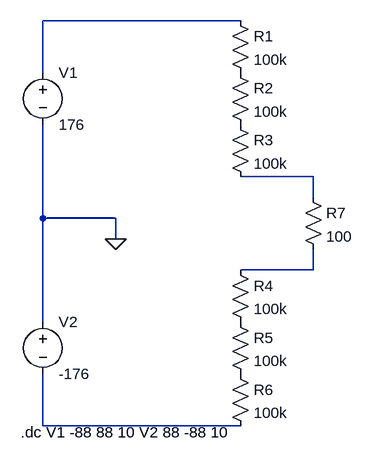
[diagram p0: schematic Voltage2.asc]
Voltage2.asc, the LTspice schematic file:
Version 4
SHEET 1 880 700
WIRE 144 48 -160 48
WIRE -160 128 -160 48
WIRE 256 288 144 288
WIRE 256 320 256 288
WIRE -160 352 -160 208
WIRE -48 352 -160 352
WIRE -48 384 -48 352
WIRE 256 432 256 400
WIRE 256 432 144 432
WIRE -160 512 -160 352
WIRE -160 672 -160 592
WIRE 144 672 -160 672
FLAG -48 384 0
SYMBOL res 128 32 R0
SYMATTR InstName R1
SYMATTR Value 100k
SYMBOL res 128 112 R0
SYMATTR InstName R2
SYMATTR Value 100k
SYMBOL res 128 192 R0
SYMATTR InstName R3
SYMATTR Value 100k
SYMBOL res 128 416 R0
SYMATTR InstName R4
SYMATTR Value 100k
SYMBOL res 128 496 R0
SYMATTR InstName R5
SYMATTR Value 100k
SYMBOL res 128 576 R0
SYMATTR InstName R6
SYMATTR Value 100k
SYMBOL res 240 304 R0
SYMATTR InstName R7
SYMATTR Value 100
SYMBOL voltage -160 112 R0
WINDOW 123 24 124 Left 2
WINDOW 39 0 0 Left 0
SYMATTR InstName V1
SYMATTR Value 176
SYMBOL voltage -160 496 R0
WINDOW 123 24 124 Left 2
WINDOW 39 0 0 Left 0
SYMATTR InstName V2
SYMATTR Value -176
TEXT -194 682 Left 2 !.dc V1 -88 88 10 V2 88 -88 10

The netlist it stands for:
* Voltage2.asc
R1 N001 P001 100k
R2 P001 P002 100k
R3 P002 N002 100k
R4 N003 P003 100k
R5 P003 P004 100k
R6 P004 N004 100k
R7 N002 N003 100
V1 N001 0 176
V2 0 N004 -176
.dc V1 -88 88 10 V2 88 -88 10
.backanno
.end